# EAGLE design Beta24_to71 (EAGLE 9.4.2)
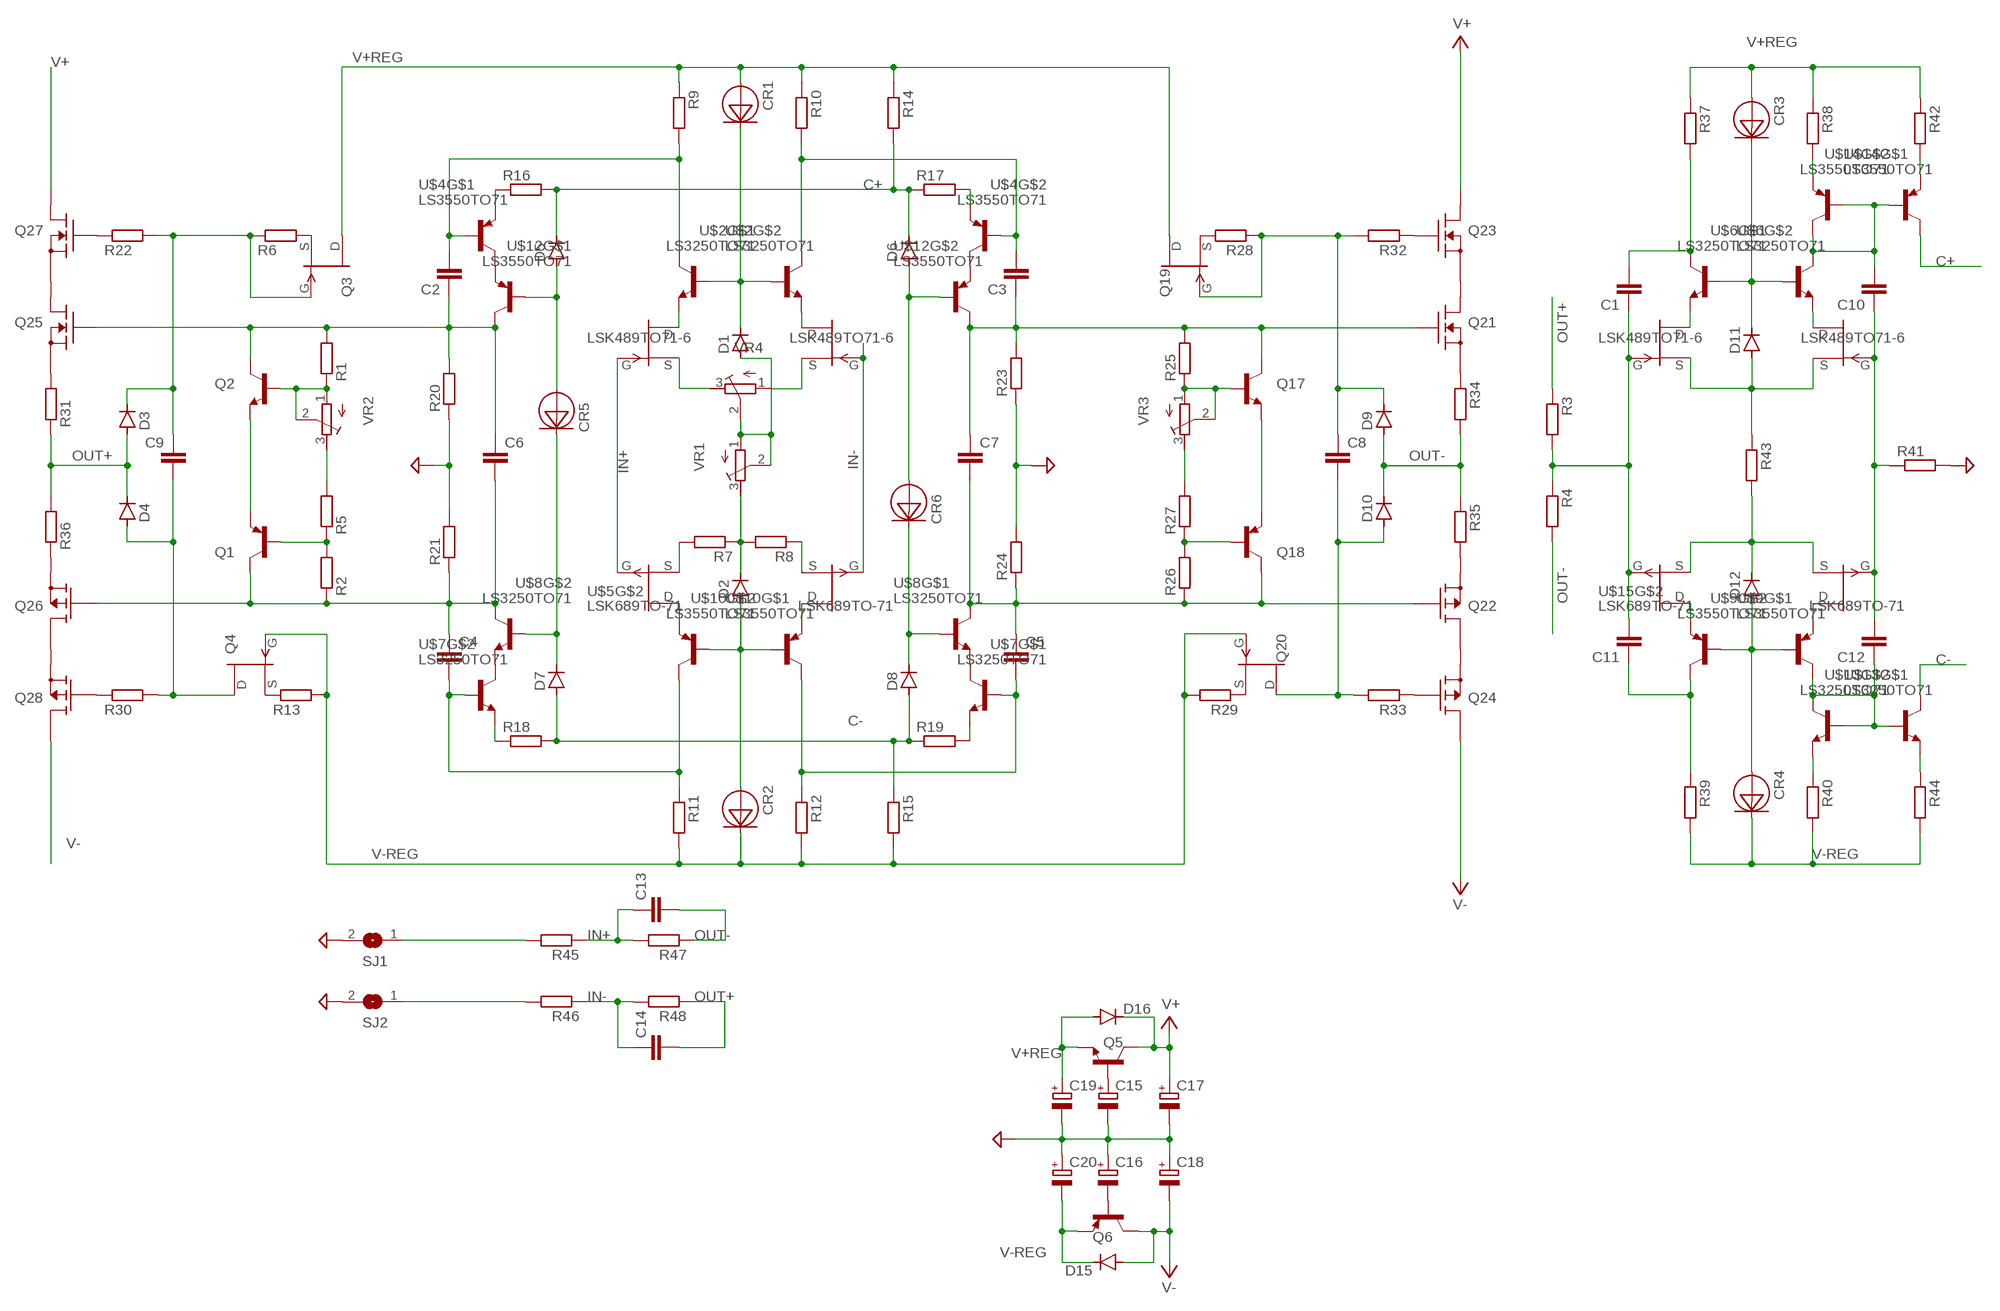
[diagram p0: schematic, sheet 1]

## Parts
C1  C-EUC1206  [C1206]
C2  C-EUC1206  [C1206]
C3  C-EUC1206  [C1206]
C4  C-EUC1206  [C1206]
C5  C-EUC1206  [C1206]
C6  C-EUC1206  [C1206]
C7  C-EUC1206  [C1206]
C8  C-EUC1206  [C1206]
C9  C-EUC1206  [C1206]
C10  C-EUC1206  [C1206]
C11  C-EUC1206  [C1206]
C12  C-EUC1206  [C1206]
C13  C-EUC1206  [C1206]
C14  C-EUC1206  [C1206]
C15  CPOL-EUE5-13  [E5-13]
C16  CPOL-EUE5-13  [E5-13]
C17  CPOL-EUE7.5-18  [E7,5-18]
C18  CPOL-EUE7.5-18  [E7,5-18]
C19  CPOL-EUE5-13  [E5-13]
C20  CPOL-EUE5-13  [E5-13]
CR1  1N5283  [SMD]
CR2  1N5283  [SMD]
CR3  1N5283  [SMD]
CR4  1N5283  [SMD]
CR5  1N5283  [SMD]
CR6  1N5283  [SMD]
D1  DIODE-SOD80C  [SOD80C]
D2  DIODE-SOD80C  [SOD80C]
D3  DIODE-SOD80C  [SOD80C]
D4  DIODE-SOD80C  [SOD80C]
D5  DIODE-SOD80C  [SOD80C]
D6  DIODE-SOD80C  [SOD80C]
D7  DIODE-SOD80C  [SOD80C]
D8  DIODE-SOD80C  [SOD80C]
D9  DIODE-SOD80C  [SOD80C]
D10  DIODE-SOD80C  [SOD80C]
D11  DIODE-SOD80C  [SOD80C]
D12  DIODE-SOD80C  [SOD80C]
D15  DIODE-SMB  [SMB]
D16  DIODE-SMB  [SMB]
Q1  TRANSISTOR_BC858C-PNP-SOT23-BEC  [TRANSISTOR_SOT23-BEC]
Q2  TRANSISTOR_BC850-NPN-SOT23-BEC  [TRANSISTOR_SOT23-BEC]
Q3  2N4392  [TO18]
Q4  2N4392  [TO18]
Q5  TRANSISTOR_MMBTA42LT1-NPN-SOT23-BEC  [TRANSISTOR_SOT23-BEC]
Q6  TRANSISTOR_MMBTA92LT1-PNP-SOT23-BEC  [TRANSISTOR_SOT23-BEC]
Q17  TRANSISTOR_BC850-NPN-SOT23-BEC  [TRANSISTOR_SOT23-BEC]
Q18  TRANSISTOR_BC858C-PNP-SOT23-BEC  [TRANSISTOR_SOT23-BEC]
Q19  2N4392  [TO18]
Q20  2N4392  [TO18]
Q21  IRFZ24N  [TO220V]
Q22  IRFZ34N  [TO220V]
Q23  IRFZ24N  [TO220V]
Q24  IRFZ34N  [TO220V]
Q25  IRFZ24N  [TO220V]
Q26  IRFZ34N  [TO220V]
Q27  IRFZ24N  [TO220V]
Q28  IRFZ34N  [TO220V]
R1  R-EU_MELF0204W  [MINI_MELF-0204W]
R2  R-EU_MELF0204W  [MINI_MELF-0204W]
R3  R-EU_MELF0204W  [MINI_MELF-0204W]
R4  R-EU_MELF0204W  [MINI_MELF-0204W]
R5  R-EU_MELF0204W  [MINI_MELF-0204W]
R6  R-EU_MELF0204W  [MINI_MELF-0204W]
R7  R-EU_MELF0204W  [MINI_MELF-0204W]
R8  R-EU_MELF0204W  [MINI_MELF-0204W]
R9  R-EU_MELF0204W  [MINI_MELF-0204W]
R10  R-EU_MELF0204W  [MINI_MELF-0204W]
R11  R-EU_MELF0204W  [MINI_MELF-0204W]
R12  R-EU_MELF0204W  [MINI_MELF-0204W]
R13  R-EU_MELF0204W  [MINI_MELF-0204W]
R14  R-EU_MELF0204W  [MINI_MELF-0204W]
R15  R-EU_MELF0204W  [MINI_MELF-0204W]
R16  R-EU_MELF0204W  [MINI_MELF-0204W]
R17  R-EU_MELF0204W  [MINI_MELF-0204W]
R18  R-EU_MELF0204W  [MINI_MELF-0204W]
R19  R-EU_MELF0204W  [MINI_MELF-0204W]
R20  R-EU_MELF0204W  [MINI_MELF-0204W]
R21  R-EU_MELF0204W  [MINI_MELF-0204W]
R22  R-EU_MELF0204W  [MINI_MELF-0204W]
R23  R-EU_MELF0204W  [MINI_MELF-0204W]
R24  R-EU_MELF0204W  [MINI_MELF-0204W]
R25  R-EU_MELF0204W  [MINI_MELF-0204W]
R26  R-EU_MELF0204W  [MINI_MELF-0204W]
R27  R-EU_MELF0204W  [MINI_MELF-0204W]
R28  R-EU_MELF0204W  [MINI_MELF-0204W]
R29  R-EU_MELF0204W  [MINI_MELF-0204W]
R30  R-EU_MELF0204W  [MINI_MELF-0204W]
R31  R-EU_TO220  [TO220-2]
R32  R-EU_MELF0204W  [MINI_MELF-0204W]
R33  R-EU_MELF0204W  [MINI_MELF-0204W]
R34  R-EU_TO220  [TO220-2]
R35  R-EU_TO220  [TO220-2]
R36  R-EU_TO220  [TO220-2]
R37  R-EU_MELF0204W  [MINI_MELF-0204W]
R38  R-EU_MELF0204W  [MINI_MELF-0204W]
R39  R-EU_MELF0204W  [MINI_MELF-0204W]
R40  R-EU_MELF0204W  [MINI_MELF-0204W]
R41  R-EU_MELF0204W  [MINI_MELF-0204W]
R42  R-EU_MELF0204W  [MINI_MELF-0204W]
R43  R-EU_MELF0204W  [MINI_MELF-0204W]
R44  R-EU_MELF0204W  [MINI_MELF-0204W]
R45  R-EU_MELF0204W  [MINI_MELF-0204W]
R46  R-EU_MELF0204W  [MINI_MELF-0204W]
R47  R-EU_MELF0204W  [MINI_MELF-0204W]
R48  R-EU_MELF0204W  [MINI_MELF-0204W]
SJ1  SJ  [SJ]
SJ2  SJ  [SJ]
U$1  LSK489TO71-6  [TO71-6]
U$2  LS3250TO71  [TO71-6]
U$3  LSK489TO71-6  [TO71-6]
U$4  LS3550TO71  [TO71-6]
U$5  LSK689TO-71  [TO71-6]
U$6  LS3250TO71  [TO71-6]
U$7  LS3250TO71  [TO71-6]
U$8  LS3250TO71  [TO71-6]
U$9  LS3550TO71  [TO71-6]
U$10  LS3550TO71  [TO71-6]
U$12  LS3550TO71  [TO71-6]
U$13  LS3250TO71  [TO71-6]
U$14  LS3550TO71  [TO71-6]
U$15  LSK689TO-71  [TO71-6]
VR1  R-TRIMM3296W  [RTRIM3296W]
VR2  R-TRIMM3296W  [RTRIM3296W]
VR3  R-TRIMM3296W  [RTRIM3296W]
VR4  R-TRIMM3296W  [RTRIM3296W]

## Nets
C+: D5.C D6.C R14.2 R16.2 R17.1 U$14.1(C)
C-: D7.A D8.A R15.1 R18.2 R19.1 U$13.1(C)
GND: C15.- C16.+ C17.- C18.+ C19.- C20.+ R20.1 R21.2 R23.1 R24.2 R41.2 SJ1.2 SJ2.2
IN+: C13.1 R45.1 R47.2 U$1.3(G) U$5.7(G)
IN-: C14.1 R46.1 R48.2 U$1.7(G) U$5.3(G)
N$1: C12.1 U$9.1(C) U$13.2(B) U$13.6(B) U$13.7(C)
N$2: U$1.6(D) U$2.5(E)
N$3: U$1.1(S) VR4.3(E)
N$4: R7.2 U$5.5(S)
N$5: U$1.2(D) U$2.3(E)
N$6: U$5.6(D) U$10.5(E)
N$7: U$1.5(S) VR4.1(A)
N$8: D2.C R7.1 R8.2 VR1.3(E)
N$9: R8.1 U$5.1(S)
N$10: U$5.2(D) U$10.3(E)
N$11: D1.A VR1.1(A) VR1.2(S) VR4.2(S)
N$12: CR2.ANODE D2.A U$10.2(B) U$10.6(B)
N$13: C2.2 R9.2 U$2.1(C) U$4.2(B)
N$14: C3.2 R10.2 U$2.7(C) U$4.6(B)
N$15: C3.1 C7.1 Q17.C Q21.1(G) R23.2 R25.2 U$12.7(C)
N$16: CR1.CATHODE D1.C U$2.2(B) U$2.6(B)
N$17: R40.1 U$13.5(E)
N$18: C5.2 R12.1 U$7.2(B) U$10.1(C)
N$19: C1.1 C11.2 R3.2 R4.1 U$3.3(G) U$15.7(G)
N$20: C8.2 D10.A Q20.2(D) R33.2
N$21: D12.C R43.2 U$15.1(S) U$15.5(S)
N$22: D11.A R43.1 U$3.1(S) U$3.5(S)
N$23: U$4.1(C) U$12.3(E)
N$24: C4.2 R11.1 U$7.6(B) U$10.7(C)
N$25: U$4.7(C) U$12.5(E)
N$26: R38.2 U$14.5(E)
N$27: R16.1 U$4.3(E)
N$28: R17.2 U$4.5(E)
N$29: C10.2 U$6.7(C) U$14.2(B) U$14.6(B) U$14.7(C)
N$30: R18.1 U$7.5(E)
N$31: R19.2 U$7.3(E)
N$32: R45.2 SJ1.1
N$33: U$3.6(D) U$6.5(E)
N$34: CR4.ANODE D12.A U$9.2(B) U$9.6(B)
N$35: C2.1 C6.1 Q2.C Q25.1(G) R1.2 R20.2 U$12.1(C)
N$36: C4.1 C6.2 Q1.C Q26.1(G) R2.1 R21.1 U$8.7(C)
N$37: U$7.1(C) U$8.3(E)
N$38: U$7.7(C) U$8.5(E)
N$39: Q17.B R25.1 VR3.1(A) VR3.2(S)
N$40: Q19.1(S) R28.2
N$41: Q20.1(S) R29.1
N$42: C1.2 R37.2 U$6.1(C)
N$43: CR5.ANODE D5.A U$12.2(B)
N$44: CR6.ANODE D6.A U$12.6(B)
N$45: CR5.CATHODE D7.C U$8.6(B)
N$46: CR6.CATHODE D8.C U$8.2(B)
N$47: Q18.B R26.2 R27.1
N$48: R27.2 VR3.3(E)
N$49: Q17.E Q18.E
N$50: C5.1 C7.2 Q18.C Q22.1(G) R24.1 R26.1 U$8.1(C)
N$51: Q1.B R2.2 R5.1
N$52: Q1.E Q2.E
N$53: R44.1 U$13.3(E)
N$54: C8.1 D9.C Q19.3(G) R28.1 R32.2
N$55: Q3.1(S) R6.2
N$56: Q4.1(S) R13.1
N$57: Q21.2(D) Q23.3(S)
N$58: Q22.2(D) Q24.3(S)
N$59: Q23.1(G) R32.1
N$60: Q24.1(G) R33.1
N$61: C9.1 D3.C Q3.3(G) R6.1 R22.2
N$62: Q21.3(S) R34.1
N$63: Q22.3(S) R35.2
N$64: C9.2 D4.A Q4.2(D) R30.2
N$65: Q25.2(D) Q27.3(S)
N$66: Q26.2(D) Q28.3(S)
N$67: Q27.1(G) R22.1
N$68: Q28.1(G) R30.1
N$69: Q25.3(S) R31.2
N$70: Q26.3(S) R36.1
N$71: Q2.B R1.1 VR2.1(A) VR2.2(S)
N$72: R5.2 VR2.3(E)
N$73: CR3.CATHODE D11.C U$6.2(B) U$6.6(B)
N$75: U$3.2(D) U$6.3(E)
N$76: C10.1 C12.2 R41.1 U$3.7(G) U$15.3(G)
N$77: U$9.5(E) U$15.6(D)
N$78: C15.+ Q5.B
N$79: U$9.3(E) U$15.2(D)
N$80: C11.1 R39.1 U$9.7(C)
N$81: R42.2 U$14.3(E)
N$82: R46.2 SJ2.1
N$83: C16.- Q6.B
OUT+: C14.2 D3.A D4.C R3.1 R31.1 R36.2 R48.1
OUT-: C13.2 D9.A D10.C R4.2 R34.2 R35.1 R47.1
V+: C17.+ D16.C Q5.C Q23.2(D) Q27.2(D)
V+REG: C19.+ CR1.ANODE CR3.ANODE D16.A Q3.2(D) Q5.E Q19.2(D) R9.1 R10.1 R14.1 R37.1 R38.1 R42.1
V-: C18.- D15.A Q6.C Q24.2(D) Q28.2(D)
V-REG: C20.- CR2.CATHODE CR4.CATHODE D15.C Q4.3(G) Q6.E Q20.3(G) R11.2 R12.2 R13.2 R15.2 R29.2 R39.2 R40.2 R44.2

## Library data of the parts
C1-C14 = Vwvwbg:C-EU: CAPACITOR, European symbol
C15-C20 = Vwvwbg:CPOL-EU: POLARIZED CAPACITOR, European symbol
CR1-CR6 = crd:1N5283: 0.22 mA through 4.23 mA current regulating diode series
D1-D12 D15 D16 = Vwvwbg:DIODE-: DIODE
Q1 Q6 Q18 = Vwvwbg:TRANSISTOR_*-PNP-: PNP Transistror
Q2 Q5 Q17 = Vwvwbg:TRANSISTOR_*-NPN-: NPN Transistror BF959 corrected 2008.03.06
Q3 Q4 Q19 Q20 = transistor-fet:2N4392: N-Channel Junction FET
Q21 Q23 Q25 Q27 = transistor-fet:IRFZ24N
Q22 Q24 Q26 Q28 = transistor-fet:IRFZ34N
R1-R48 = Vwvwbg:R-EU_: RESISTOR, European symbol
SJ1 SJ2 = jumper:SJ: SMD solder JUMPER
U$1 U$3 = Vwvwbg:LSK489
U$2 U$6-U$8 U$13 = Vwvwbg:LS3250
U$4 U$9 U$10 U$12 U$14 = Vwvwbg:LS3550
U$5 U$15 = Vwvwbg:LSK689
VR1-VR4 = resistor:R-TRIMM: Trimm resistor

## Board
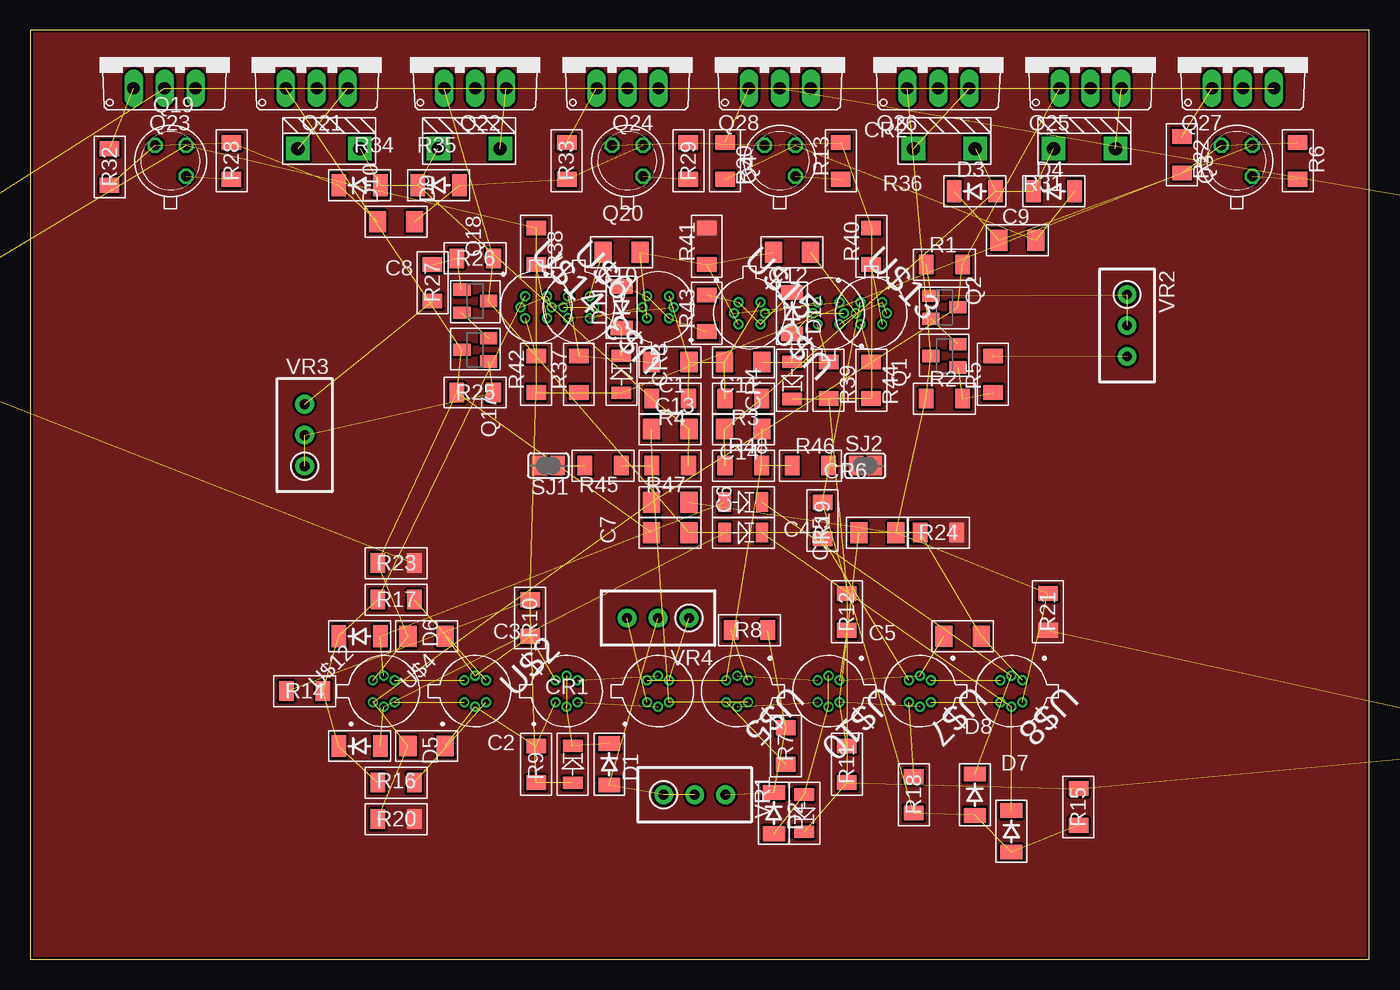
[diagram p1: board, top side]
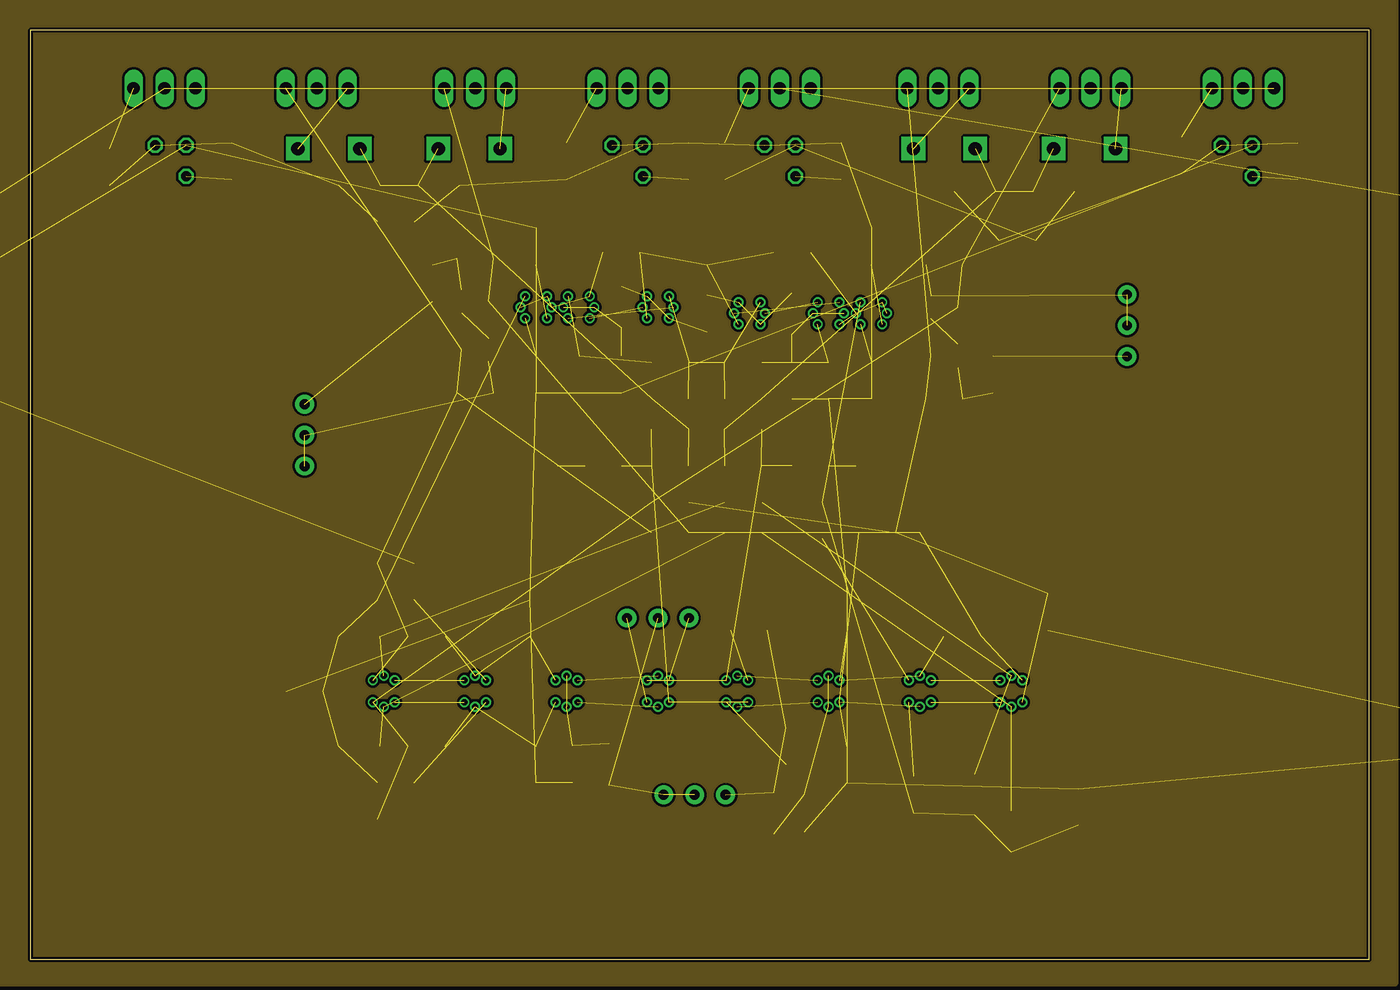
[diagram p2: board, inner layer Route2]

Size 109.85 x 76.2 mm. Coordinates in mm from the lower left corner, seen from the top.
Outline: 0,0 109.85,0 109.85,76.2 0,76.2 0,0
Copper layers (1+2*15+16): Top 0.035mm / dielectric 1.5mm / Route2 0.035mm / dielectric 0.15mm / Route15 0.035mm / dielectric 0.2mm / Bottom 0.035mm
Design rules "default *": minimum track width 10mil, minimum drill 0.4mm, track to track 8mil, track to pad 8mil, pad to pad 4mil, via to via 8mil, smd to smd 8mil, copper to edge 8mil, drill to drill 8mil, minimum pad ring 0mil, minimum via ring 8mil, stop-mask expansion 4mil, vias tented up to drill 0mil, thermal gap 15mil

### Footprints (pad centres in the part's own frame; a part is rotated, then mirrored left to right if it is on the bottom)
C1206 = smd 1.4 x 1.7: 1 -1.527,0; 2 1.527,0
E5-13 = drill 1.5 pad 3.81: + -2.54,0 | drill 1.5 pad 3.81 octagon: - 2.54,0
E7,5-18 = drill 1.5 pad 3.81: + -3.81,0 | drill 1.5 pad 3.81 octagon: - 3.81,0
SMD = smd 1 x 1.6: ANODE 1.525,0; CATHODE -1.525,0
SOD80C = smd 1.2 x 1.8: A 1.7,0; C -1.7,0
SMB = smd 2.4 x 2.4: A 2.2,0; C -2.2,0
TRANSISTOR_SOT23-BEC = smd 1 x 1.4: B -0.95,-1.1; C 0,1.1; E 0.95,-1.1
TO18 = drill 0.813 octagon: 1 -1.27,-1.27; 2 1.27,-1.27; 3 1.27,1.27
TO220V = drill 1.016 long: 1 -2.54,-2.54; 2 0,-2.54; 3 2.54,-2.54
MINI_MELF-0204W = smd 1.2 x 1.6: 1 -1.5,0; 2 1.5,0
TO220-2 = drill 1.1 pad 1.93 square: 1 -2.54,0; 2 2.54,0
SJ = smd 1.168 x 1.6: 1 -0.762,0; 2 0.762,0
TO71-6 = drill 0.508 pad 0.813: 1 -1.27,0; 2 -0.898,-0.898; 3 0,-1.27; 5 1.27,0; 6 0.898,0.898; 7 0,1.27
RTRIM3296W = drill 0.8 pad 1.524: 1 0,-2.54; 2 0,0; 3 0,2.54

### Placement (x,y rotation side)
C1  52.5,49 180 top
C2  32.5,17.5 0 top
C3  32.5,26.5 0 top
C4  69.5,35 180 top
C5  76.5,26.5 180 top
C6  52.5,37.5 0 top
C7  52.5,35 0 top
C8  30,60.5 0 top
C9  81,59 0 top
C10  48.5,58 180 top
C11  58.5,49 180 top
C12  62.5,58 180 top
C13  52.5,43.5 0 top
C14  58.5,43.5 180 top
C15  -33,33 180 top  (outside the outline)
C16  128,37 270 top  (outside the outline)
C17  -32.5,56 0 top  (outside the outline)
C18  129,60.5 180 top  (outside the outline)
C19  -32.5,18 180 top  (outside the outline)
C20  127,18 0 top  (outside the outline)
CR1  44.5,16 270 top
CR2  63.5,12 90 top
CR3  48.5,48 270 top
CR4  62.5,47.5 90 top
CR5  58.5,35 180 top
CR6  58.5,37.5 180 top
D1  47.5,16 270 top
D2  61,12 270 top
D3  77.5,63 0 top
D4  84,63 0 top
D5  27,17.5 0 top
D6  27,26.5 0 top
D7  80.5,10.5 270 top
D8  77.5,13.5 270 top
D9  27,63.5 0 top
D10  33.5,63.5 0 top
D11  48.5,53.5 90 top
D12  62.5,53 270 top
D15  133.5,48 90 top  (outside the outline)
D16  -28,44.5 270 top  (outside the outline)
Q1  75,49.5 90 top
Q2  75,53.5 270 top
Q3  99,65.5 90 top
Q4  61.5,65.5 90 top
Q5  -34,45 270 top  (outside the outline)
Q6  128.5,48.5 0 top  (outside the outline)
Q17  36.5,50 90 top
Q18  36.5,54 270 top
Q19  11.5,65.5 90 top
Q20  49,65.5 90 top
Q21  23.5,74 0 top
Q22  36.5,74 0 top
Q23  11,74 0 top
Q24  49,74 0 top
Q25  87,74 0 top
Q26  74.5,74 0 top
Q27  99.5,74 0 top
Q28  61.5,74 0 top
R1  75,57 0 top
R2  75,46 0 top
R3  58.5,46 180 top
R4  52.5,46 180 top
R5  79,48 90 top
R6  104,65.5 270 top
R7  62,17.5 270 top
R8  59,27 0 top
R9  41.5,16 90 top
R10  41,28 270 top
R11  67,16 270 top
R12  67,28.5 90 top
R13  66.5,65.5 90 top
R14  22.5,22 0 top
R15  86,12.5 90 top
R16  30,14.5 180 top
R17  30,29.5 0 top
R18  72.5,13.5 270 top
R19  65,36 270 top
R20  30,11.5 180 top
R21  83.5,28.5 270 top
R22  94.5,66 270 top
R23  30,32.5 180 top
R24  74.5,35 0 top
R25  36.5,46.5 180 top
R26  36.5,57.5 180 top
R27  33,55.5 270 top
R28  16.5,65.5 270 top
R29  54,65.5 90 top
R30  57,65.5 270 top
R31  86.5,66.5 0 top
R32  6.5,65 270 top
R33  44,65.5 270 top
R34  24.5,66.5 0 top
R35  36,66.5 0 top
R36  75,66.5 0 top
R37  45,48 90 top
R38  41.5,58.5 270 top
R39  65.5,47.5 270 top
R40  69,58.5 90 top
R41  55.5,58.5 90 top
R42  41.5,48 90 top
R43  55.5,53 90 top
R44  69,47.5 270 top
R45  47,40.5 180 top
R46  64,40.5 0 top
R47  52.5,40.5 180 top
R48  58.5,40.5 0 top
SJ1  42.5,40.5 180 top
SJ2  68.5,40.5 0 top
U$1  51.5,22 45 top
U$2  44,22 45 top
U$3  51.5,53.5 135 top
U$4  36.5,22 45 top
U$5  58,22 225 top
U$6  45,53.5 315 top
U$7  73,22 225 top
U$8  80.5,22 225 top
U$9  65.5,53 135 top
U$10  65.5,22 225 top
U$12  29,22 45 top
U$13  69,53 315 top
U$14  41.5,53.5 315 top
U$15  59,53 315 top
VR1  54.5,13.5 270 top
VR2  90,52 180 top
VR3  22.5,43 0 top
VR4  51.5,28 90 top

### Tracks (layer width: path | path; a pad name or v marks a point on that pad's centre or on a via)
C+  (5 unrouted)
C-  (5 unrouted)
GND  (6 unrouted)
  pour Top (no thermals): 0,78.48 0,0 113.41,0 113.41,78.48
  pour Route2: -5.5,78.75 112,78.75 112,-2 -4,-2 -5.25,-2 -5.5,-1.75
IN+  (4 unrouted)
IN-  (4 unrouted)
N$1  (4 unrouted)
N$2  (1 unrouted)
N$3  (1 unrouted)
N$4  (1 unrouted)
N$5  (1 unrouted)
N$6  (1 unrouted)
N$7  (1 unrouted)
N$8  (3 unrouted)
N$9  (1 unrouted)
N$10  (1 unrouted)
N$11  (3 unrouted)
N$12  (3 unrouted)
N$13  (3 unrouted)
N$14  (3 unrouted)
N$15  (6 unrouted)
N$16  (3 unrouted)
N$17  (1 unrouted)
N$18  (3 unrouted)
N$19  (5 unrouted)
N$20  (3 unrouted)
N$21  (3 unrouted)
N$22  (3 unrouted)
N$23  (1 unrouted)
N$24  (3 unrouted)
N$25  (1 unrouted)
N$26  (1 unrouted)
N$27  (1 unrouted)
N$28  (1 unrouted)
N$29  (4 unrouted)
N$30  (1 unrouted)
N$31  (1 unrouted)
N$32  (1 unrouted)
N$33  (1 unrouted)
N$34  (3 unrouted)
N$35  (6 unrouted)
N$36  (6 unrouted)
N$37  (1 unrouted)
N$38  (1 unrouted)
N$39  (3 unrouted)
N$40  (1 unrouted)
N$41  (1 unrouted)
N$42  (2 unrouted)
N$43  (2 unrouted)
N$44  (2 unrouted)
N$45  (2 unrouted)
N$46  (2 unrouted)
N$47  (2 unrouted)
N$48  (1 unrouted)
N$49  (1 unrouted)
N$50  (6 unrouted)
N$51  (2 unrouted)
N$52  (1 unrouted)
N$53  (1 unrouted)
N$54  (4 unrouted)
N$55  (1 unrouted)
N$56  (1 unrouted)
N$57  (1 unrouted)
N$58  (1 unrouted)
N$59  (1 unrouted)
N$60  (1 unrouted)
N$61  (4 unrouted)
N$62  (1 unrouted)
N$63  (1 unrouted)
N$64  (3 unrouted)
N$65  (1 unrouted)
N$66  (1 unrouted)
N$67  (1 unrouted)
N$68  (1 unrouted)
N$69  (1 unrouted)
N$70  (1 unrouted)
N$71  (3 unrouted)
N$72  (1 unrouted)
N$73  (3 unrouted)
N$75  (1 unrouted)
N$76  (4 unrouted)
N$77  (1 unrouted)
N$78  (1 unrouted)
N$79  (1 unrouted)
N$80  (2 unrouted)
N$81  (1 unrouted)
N$82  (1 unrouted)
N$83  (1 unrouted)
OUT+  (6 unrouted)
OUT-  (6 unrouted)
V+  (4 unrouted)
V+REG  (12 unrouted)
V-  (4 unrouted)
V-REG  (14 unrouted)